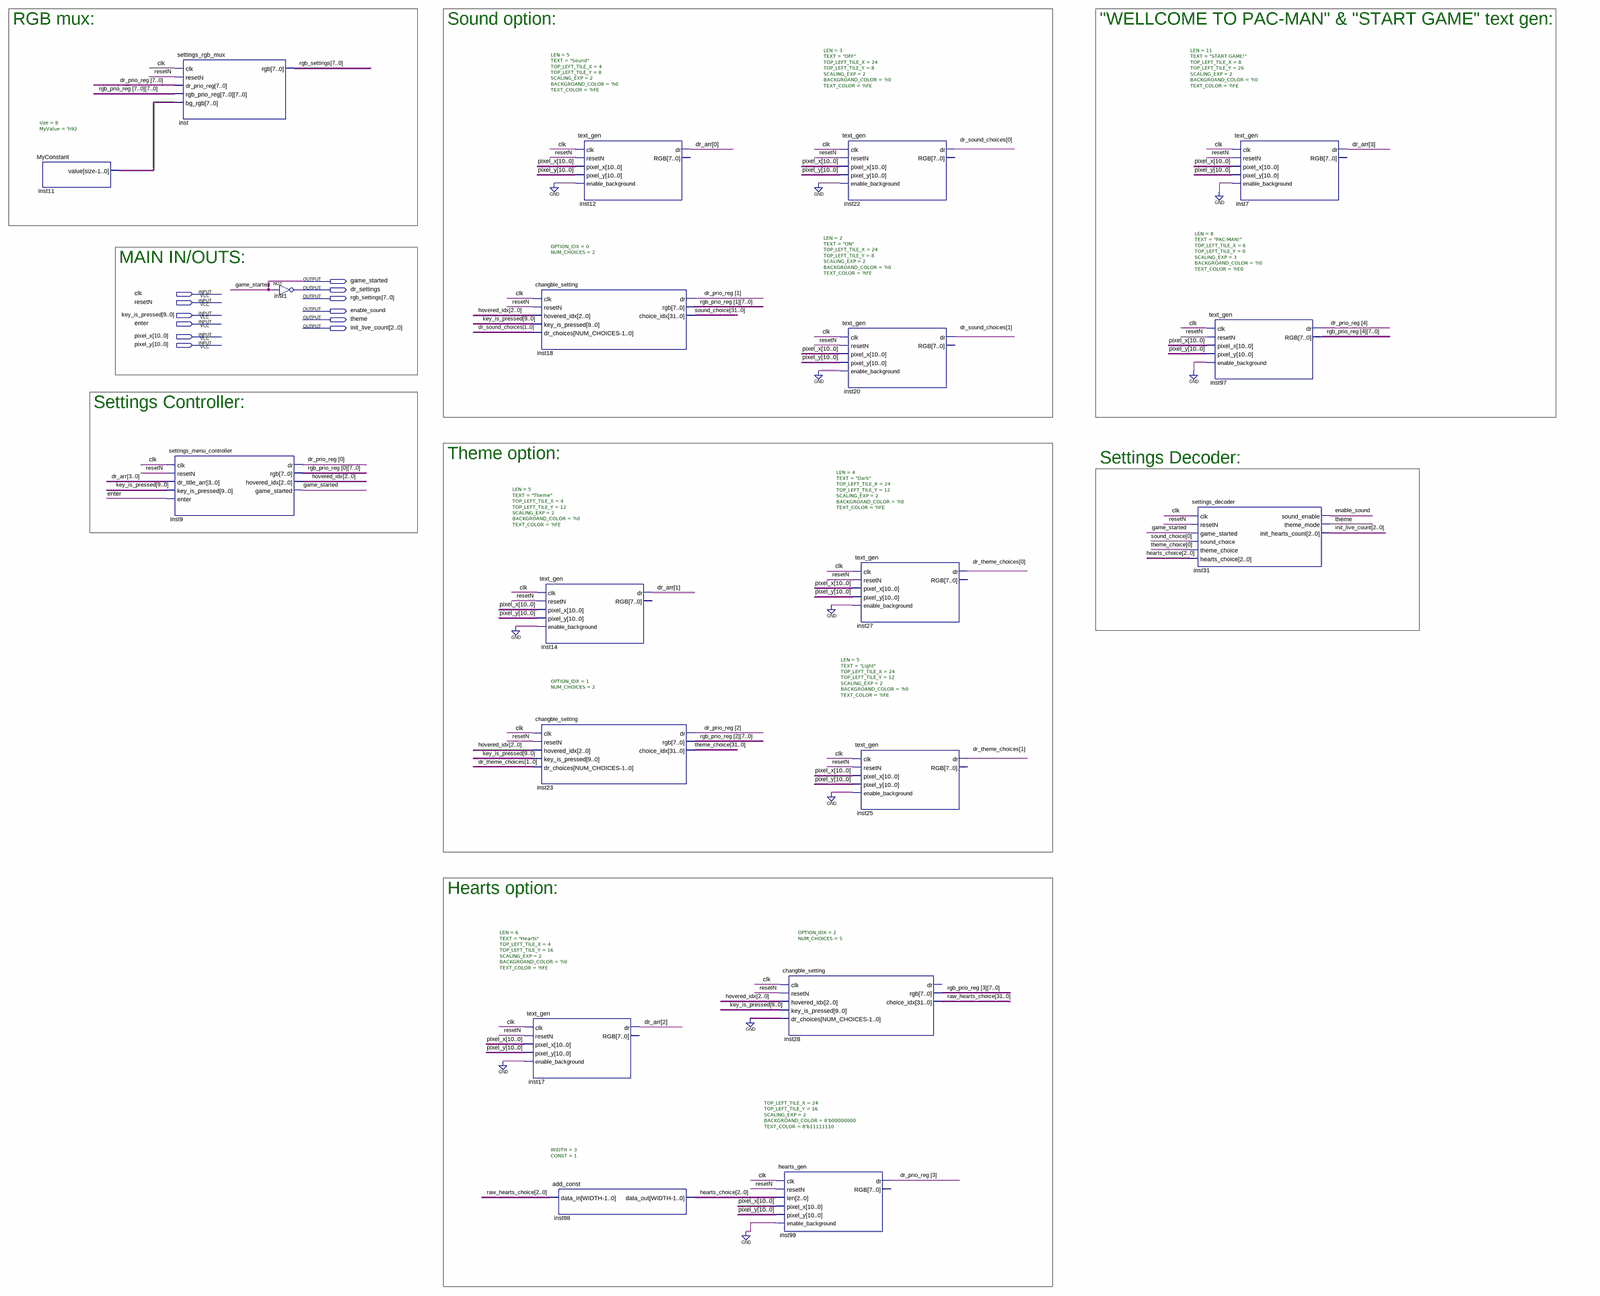
[diagram p0: schematic sheet, whole]
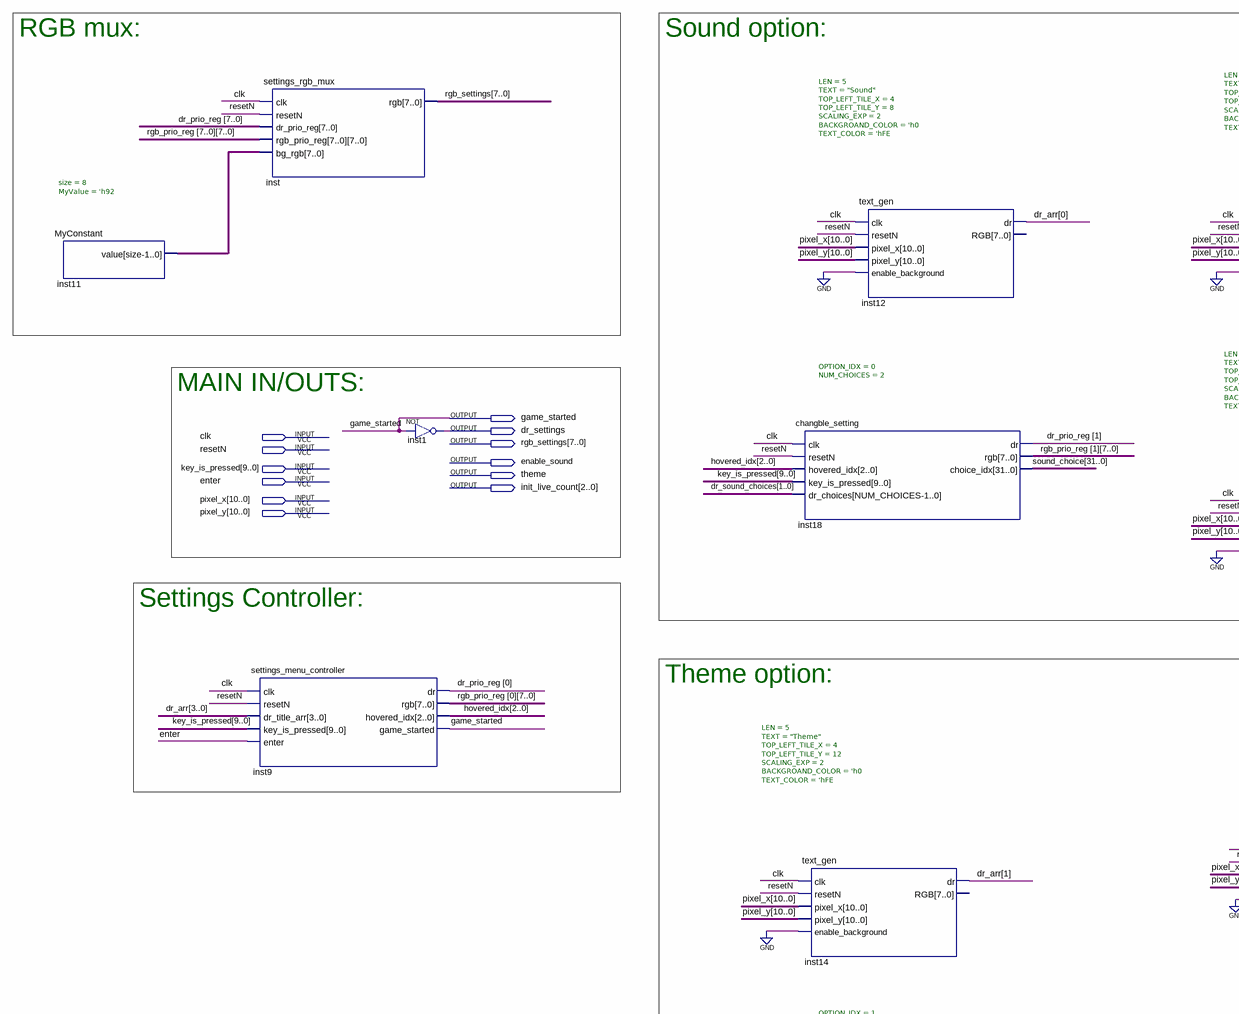
[diagram p1: schematic sheet, upper left part]
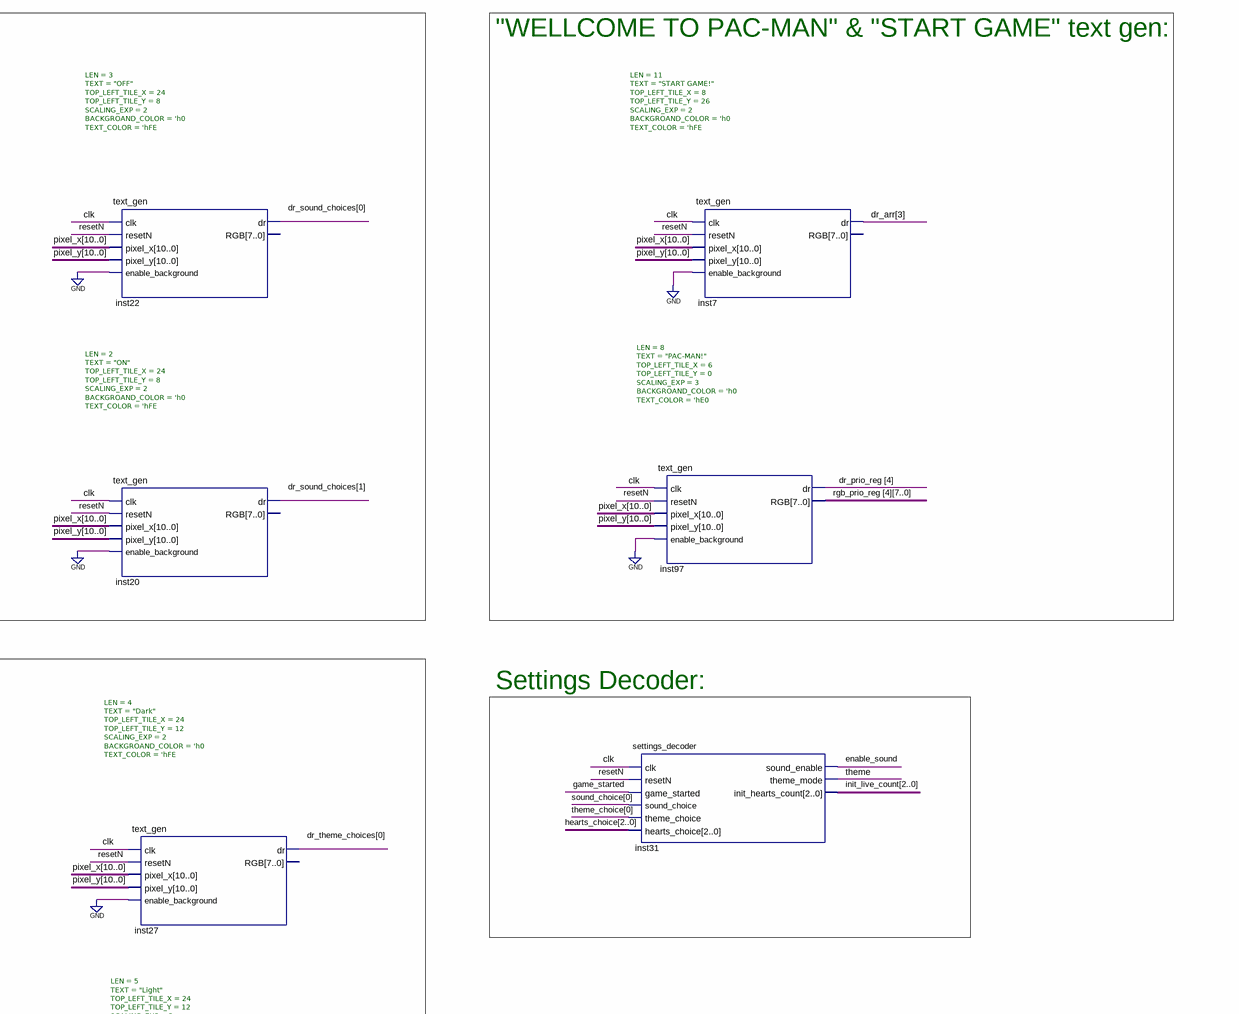
[diagram p2: schematic sheet, upper right part]
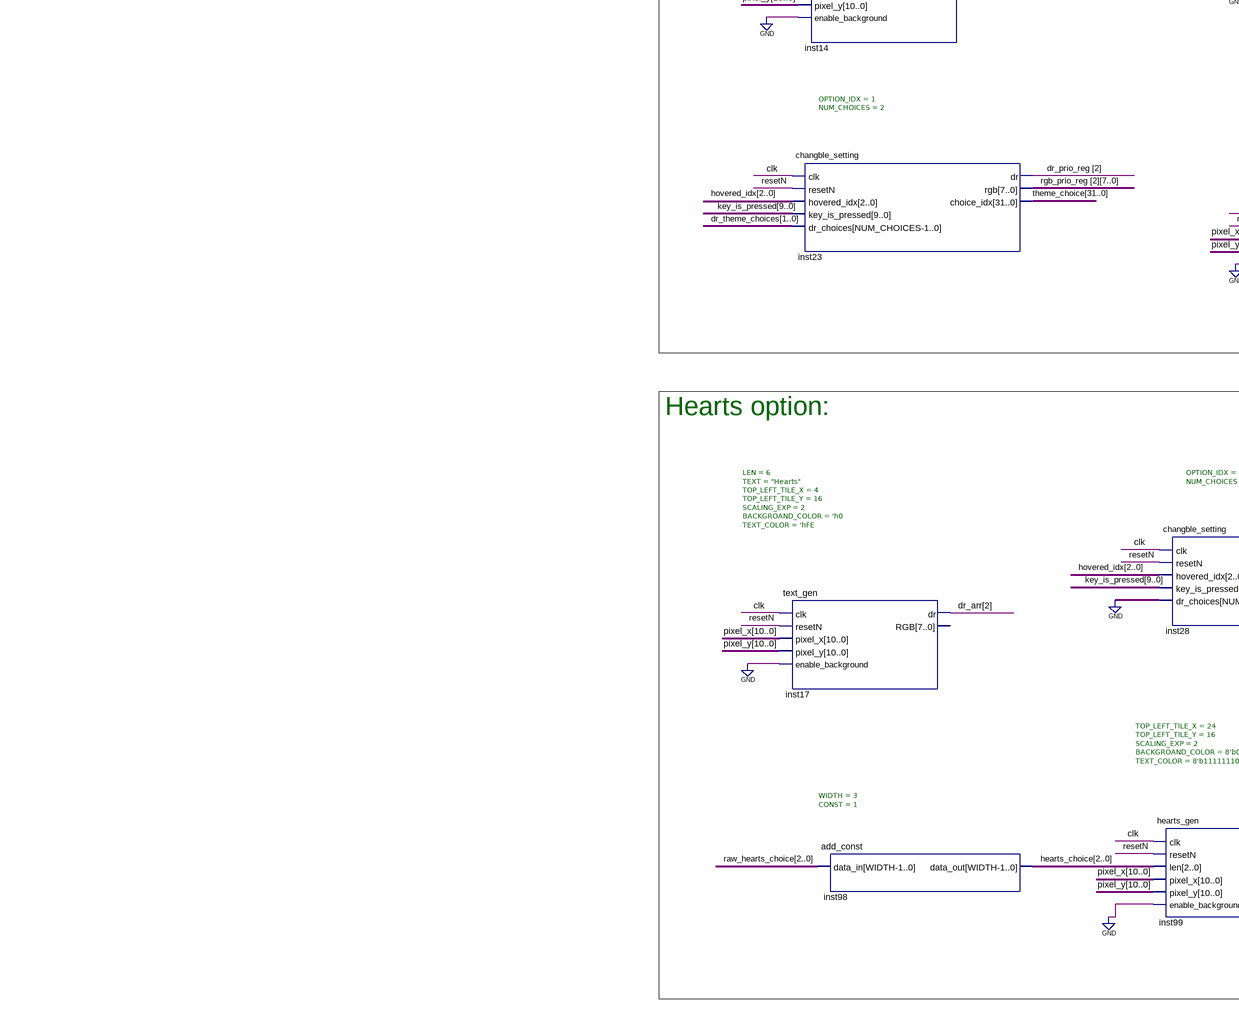
[diagram p3: schematic sheet, lower left part]
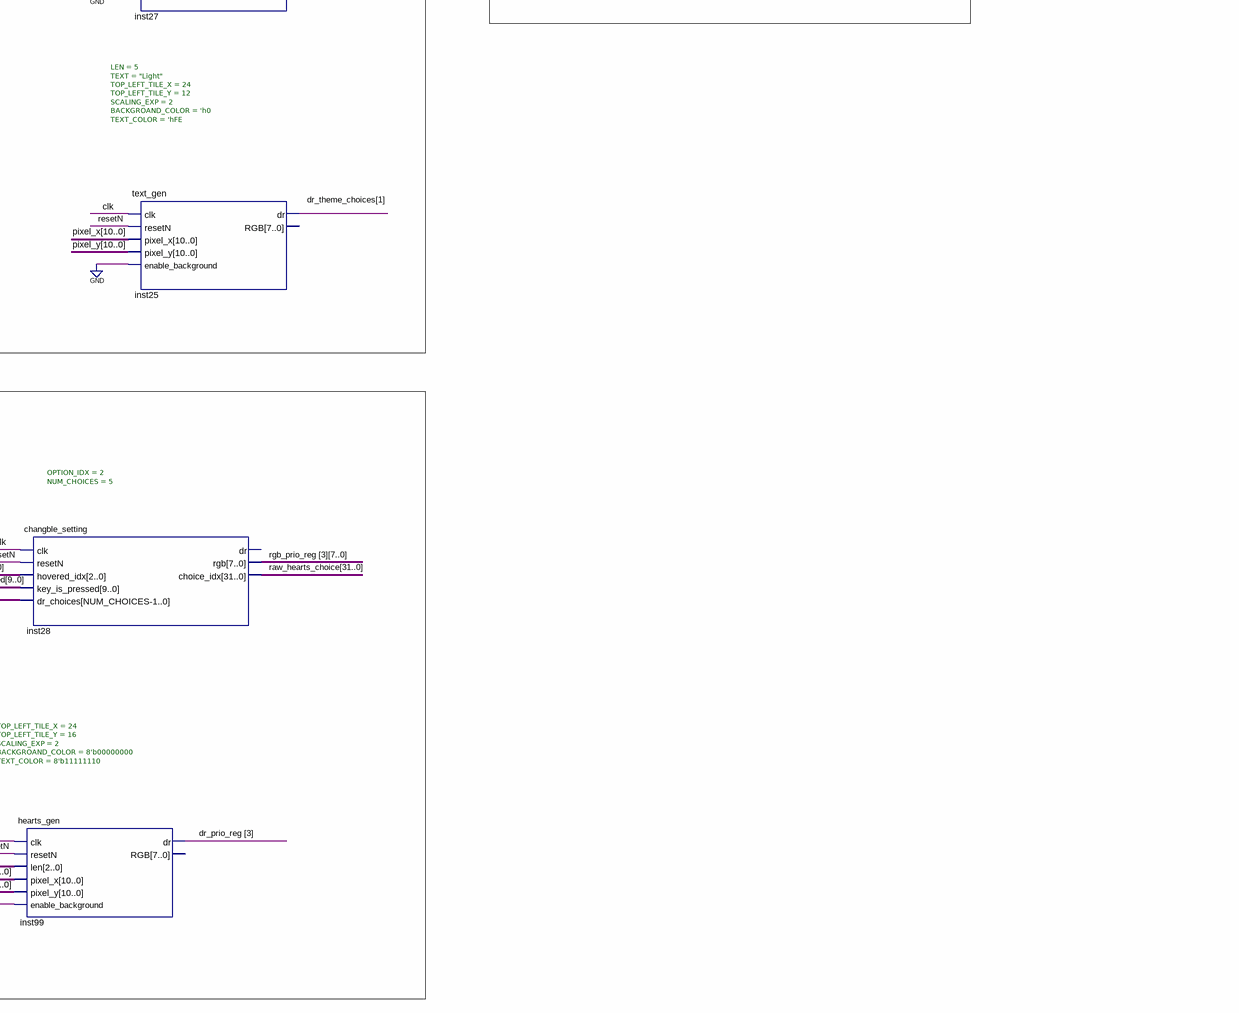
[diagram p4: schematic sheet, lower right part]
// Quartus schematic TOP_SETTINGS_MENU.bdf as structural Verilog: 19 symbols, 12 pins
module TOP_SETTINGS_MENU (
  input  clk,
  input  resetN,
  input  [9:0] key_is_pressed,
  input  enter,
  input  [10:0] pixel_x,
  input  [10:0] pixel_y,
  output game_started,
  output dr_settings,
  output [7:0] rgb_settings,
  output enable_sound,
  output theme,
  output [2:0] init_live_count
);

  wire [1:0] dr_sound_choices, dr_theme_choices;
  wire [2:0] hearts_choice, hovered_idx;
  wire [3:0] dr_arr;
  wire [7:0] dr_prio_reg, inst11_value, rgb_prio_reg_0, rgb_prio_reg_1, rgb_prio_reg_2, rgb_prio_reg_3,
       rgb_prio_reg_4, rgb_prio_reg_5, rgb_prio_reg_6, rgb_prio_reg_7;
  wire [31:0] raw_hearts_choice, sound_choice, theme_choice;

  MyConstant #(.size(8), .MyValue('h92)) inst11 (.value(inst11_value));
  settings_rgb_mux inst (
    .clk(clk), .resetN(resetN), .dr_prio_reg(dr_prio_reg),
    .rgb_prio_reg({rgb_prio_reg_7, rgb_prio_reg_6, rgb_prio_reg_5, rgb_prio_reg_4, rgb_prio_reg_3, rgb_prio_reg_2, rgb_prio_reg_1, rgb_prio_reg_0}),
    .bg_rgb(inst11_value), .rgb(rgb_settings));
  settings_menu_controller inst9 (
    .clk(clk), .resetN(resetN), .dr_title_arr(dr_arr), .key_is_pressed(key_is_pressed), .enter(enter),
    .dr(dr_prio_reg[0]), .rgb(rgb_prio_reg_0), .hovered_idx(hovered_idx), .game_started(game_started));
  not inst1 (dr_settings, game_started);
  changble_setting #(.OPTION_IDX(0), .NUM_CHOICES(2)) inst18 (
    .clk(clk), .resetN(resetN), .hovered_idx(hovered_idx), .key_is_pressed(key_is_pressed),
    .dr_choices(dr_sound_choices), .dr(dr_prio_reg[1]), .rgb(rgb_prio_reg_1), .choice_idx(sound_choice));
  text_gen #(.LEN(5), .TEXT("Theme"), .TOP_LEFT_TILE_X(4), .TOP_LEFT_TILE_Y(12), .SCALING_EXP(2), .BACKGROAND_COLOR('h0), .TEXT_COLOR('hFE)) inst14 (
    .clk(clk), .resetN(resetN), .pixel_x(pixel_x), .pixel_y(pixel_y), .enable_background(1'b0), .dr(dr_arr[1]));  // open: RGB
  changble_setting #(.OPTION_IDX(1), .NUM_CHOICES(2)) inst23 (
    .clk(clk), .resetN(resetN), .hovered_idx(hovered_idx), .key_is_pressed(key_is_pressed),
    .dr_choices(dr_theme_choices), .dr(dr_prio_reg[2]), .rgb(rgb_prio_reg_2), .choice_idx(theme_choice));
  text_gen #(.LEN(6), .TEXT("Hearts"), .TOP_LEFT_TILE_X(4), .TOP_LEFT_TILE_Y(16), .SCALING_EXP(2), .BACKGROAND_COLOR('h0), .TEXT_COLOR('hFE)) inst17 (
    .clk(clk), .resetN(resetN), .pixel_x(pixel_x), .pixel_y(pixel_y), .enable_background(1'b0), .dr(dr_arr[2]));  // open: RGB
  add_const #(.WIDTH(3), .CONST(1)) inst98 (.data_in(raw_hearts_choice[2:0]), .data_out(hearts_choice));
  text_gen #(.LEN(5), .TEXT("Sound"), .TOP_LEFT_TILE_X(4), .TOP_LEFT_TILE_Y(8), .SCALING_EXP(2), .BACKGROAND_COLOR('h0), .TEXT_COLOR('hFE)) inst12 (
    .clk(clk), .resetN(resetN), .pixel_x(pixel_x), .pixel_y(pixel_y), .enable_background(1'b0), .dr(dr_arr[0]));  // open: RGB
  changble_setting #(.OPTION_IDX(2), .NUM_CHOICES(5)) inst28 (
    .clk(clk), .resetN(resetN), .hovered_idx(hovered_idx), .key_is_pressed(key_is_pressed),
    .dr_choices({5{1'b0}}), .rgb(rgb_prio_reg_3), .choice_idx(raw_hearts_choice));  // open: dr
  hearts_gen #(.TOP_LEFT_TILE_X(24), .TOP_LEFT_TILE_Y(16), .SCALING_EXP(2), .BACKGROAND_COLOR(8'b00000000), .TEXT_COLOR(8'b11111110)) inst99 (
    .clk(clk), .resetN(resetN), .len(hearts_choice), .pixel_x(pixel_x), .pixel_y(pixel_y),
    .enable_background(1'b0), .dr(dr_prio_reg[3]));  // open: RGB
  text_gen #(.LEN(3), .TEXT("OFF"), .TOP_LEFT_TILE_X(24), .TOP_LEFT_TILE_Y(8), .SCALING_EXP(2), .BACKGROAND_COLOR('h0), .TEXT_COLOR('hFE)) inst22 (
    .clk(clk), .resetN(resetN), .pixel_x(pixel_x), .pixel_y(pixel_y), .enable_background(1'b0),
    .dr(dr_sound_choices[0]));  // open: RGB
  text_gen #(.LEN(2), .TEXT("ON"), .TOP_LEFT_TILE_X(24), .TOP_LEFT_TILE_Y(8), .SCALING_EXP(2), .BACKGROAND_COLOR('h0), .TEXT_COLOR('hFE)) inst20 (
    .clk(clk), .resetN(resetN), .pixel_x(pixel_x), .pixel_y(pixel_y), .enable_background(1'b0),
    .dr(dr_sound_choices[1]));  // open: RGB
  text_gen #(.LEN(4), .TEXT("Dark"), .TOP_LEFT_TILE_X(24), .TOP_LEFT_TILE_Y(12), .SCALING_EXP(2), .BACKGROAND_COLOR('h0), .TEXT_COLOR('hFE)) inst27 (
    .clk(clk), .resetN(resetN), .pixel_x(pixel_x), .pixel_y(pixel_y), .enable_background(1'b0),
    .dr(dr_theme_choices[0]));  // open: RGB
  text_gen #(.LEN(5), .TEXT("Light"), .TOP_LEFT_TILE_X(24), .TOP_LEFT_TILE_Y(12), .SCALING_EXP(2), .BACKGROAND_COLOR('h0), .TEXT_COLOR('hFE)) inst25 (
    .clk(clk), .resetN(resetN), .pixel_x(pixel_x), .pixel_y(pixel_y), .enable_background(1'b0),
    .dr(dr_theme_choices[1]));  // open: RGB
  settings_decoder inst31 (
    .clk(clk), .resetN(resetN), .game_started(game_started), .sound_choice(sound_choice[0]),
    .theme_choice(theme_choice[0]), .hearts_choice(hearts_choice), .sound_enable(enable_sound),
    .theme_mode(theme), .init_hearts_count(init_live_count));
  text_gen #(.LEN(11), .TEXT("START GAME!"), .TOP_LEFT_TILE_X(8), .TOP_LEFT_TILE_Y(26), .SCALING_EXP(2), .BACKGROAND_COLOR('h0), .TEXT_COLOR('hFE)) inst7 (
    .clk(clk), .resetN(resetN), .pixel_x(pixel_x), .pixel_y(pixel_y), .enable_background(1'b0), .dr(dr_arr[3]));  // open: RGB
  text_gen #(.LEN(8), .TEXT("PAC-MAN!"), .TOP_LEFT_TILE_X(6), .TOP_LEFT_TILE_Y(0), .SCALING_EXP(3), .BACKGROAND_COLOR('h0), .TEXT_COLOR('hE0)) inst97 (
    .clk(clk), .resetN(resetN), .pixel_x(pixel_x), .pixel_y(pixel_y), .enable_background(1'b0),
    .dr(dr_prio_reg[4]), .RGB(rgb_prio_reg_4));

  // Notes on the sheet:
  //   RGB mux:
  //   Sound option:
  //   "WELLCOME TO PAC-MAN" & "START GAME" text gen:
  //   MAIN IN/OUTS:
  //   Settings Controller:
  //   Theme option:
  //   Settings Decoder:
  //   Hearts option:
endmodule
